# EAGLE schematic ManualOxy (EAGLE 6.5.0)
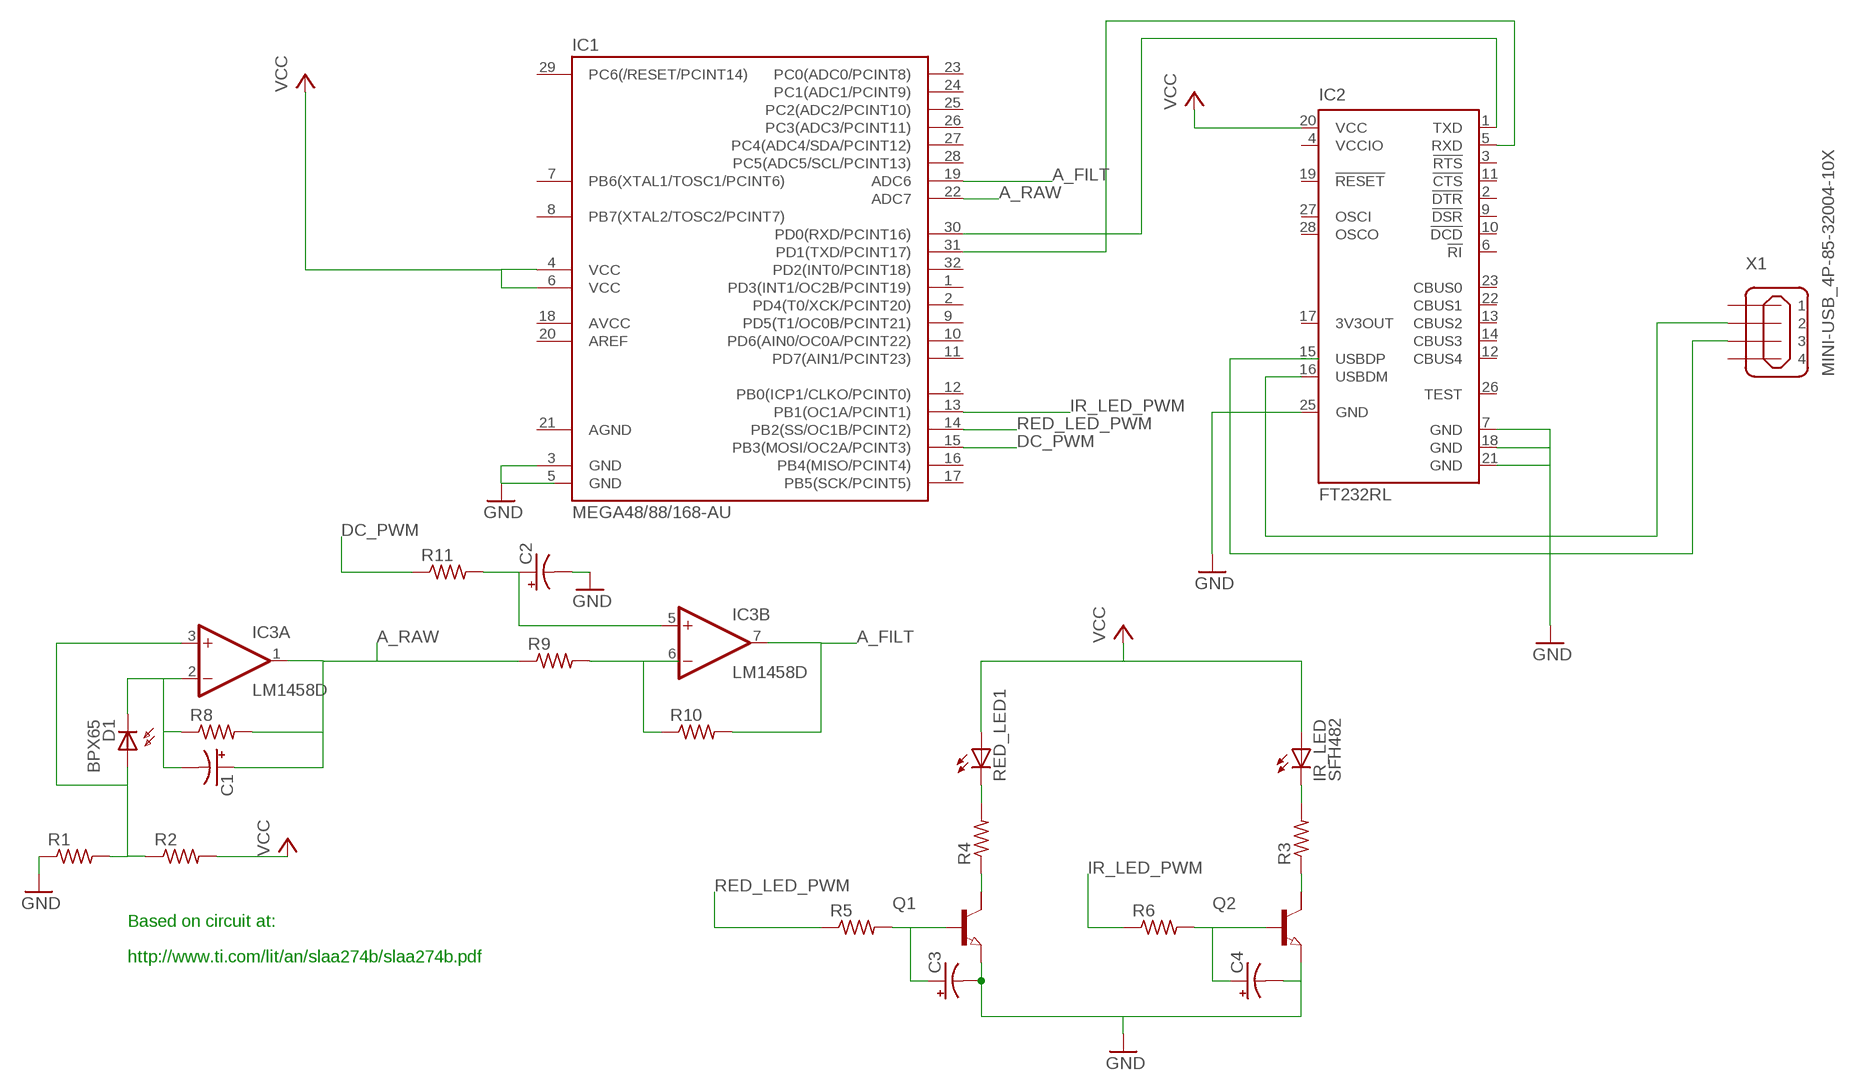
[diagram p0: schematic, sheet 1]

## Parts
C1  CPOL-US153CLV-0810  [153CLV-0810]
C2  CPOL-US153CLV-0810  [153CLV-0810]
C3  CPOL-US153CLV-0810  [153CLV-0810]
C4  CPOL-US153CLV-0810  [153CLV-0810]
D1  BPX65  [BPX65]
IC1  MEGA48/88/168-AU  [TQFP32-08]
IC2  FT232RL  [SSOP28]
IC3  LM1458D  [SO08]
IR_LED  SFH482  [SFH482]
Q1  NPN-TRANSISTIOR-2COLSOT143  [SOT143]
Q2  NPN-TRANSISTIOR-2COLSOT143  [SOT143]
R1  R-US_M2012  [M2012]
R2  R-US_M2012  [M2012]
R3  R-US_M2012  [M2012]
R4  R-US_M2012  [M2012]
R5  R-US_M2012  [M2012]
R6  R-US_M2012  [M2012]
R8  R-US_M2012  [M2012]
R9  R-US_M2012  [M2012]
R10  R-US_M2012  [M2012]
R11  R-US_M2012  [M2012]
RED_LED1  LED10MM  [LED10MM]
X1  MINI-USB_4P-85-32004-10X  [85-32004-10X]

## Nets
A_FILT: IC3.7(B:OUT) R10.2
A_RAW: C1.+ IC3.1(A:OUT) R8.2 R9.1
DC_PWM: IC1.15(PB3(MOSI/OC2A/PCINT3))
GND: C2.- C3.- C4.- IC1.3(GND) IC2.7(GND) IC2.18(GND) IC2.21(GND) IC2.25(GND) Q1.3(E) Q2.3(E) R1.1
IR_LED_PWM: IC1.13(PB1(OC1A/PCINT1))
N$1: IC1.30(PD0(RXD/PCINT16)) IC2.1(TXD)
N$2: IC1.31(PD1(TXD/PCINT17)) IC2.5(RXD)
N$3: IC2.16(USBDM) X1.2
N$4: X1.3
N$5: Q1.2(C) R4.1
N$6: R4.2 RED_LED1.K(C)
N$7: IR_LED.K(C) R3.2
N$8: Q2.2(C) R3.1
N$9: D1.A IC3.3(A:+IN) R1.2 R2.1
N$10: C1.- D1.K(C) IC3.2(A:-IN) R8.1
N$11: IC1.22(ADC7)
N$12: R9.2 R10.1
N$13: IC1.19(ADC6)
N$14: C2.+ IC3.5(B:+IN) R11.2
N$15: R11.1
N$16: C3.+ Q1.1(B) R5.2
N$17: R6.1
N$18: C4.+ Q2.1(B) R6.2
RED_LED_PWM: IC1.14(PB2(SS/OC1B/PCINT2))
VCC: IC1.4(VCC) IC1.6(VCC) IC2.20(VCC) IR_LED.A R2.2 RED_LED1.A
Unconnected: IC1.1(PD3(INT1/OC2B/PCINT19)) IC1.2(PD4(T0/XCK/PCINT20)) IC1.7(PB6(XTAL1/TOSC1/PCINT6)) IC1.8(PB7(XTAL2/TOSC2/PCINT7)) IC1.9(PD5(T1/OC0B/PCINT21)) IC1.10(PD6(AIN0/OC0A/PCINT22)) IC1.11(PD7(AIN1/PCINT23)) IC1.12(PB0(ICP1/CLKO/PCINT0)) IC1.16(PB4(MISO/PCINT4)) IC1.17(PB5(SCK/PCINT5)) IC1.18(AVCC) IC1.20(AREF) IC1.23(PC0(ADC0/PCINT8)) IC1.24(PC1(ADC1/PCINT9)) IC1.25(PC2(ADC2/PCINT10)) IC1.26(PC3(ADC3/PCINT11)) IC1.27(PC4(ADC4/SDA/PCINT12)) IC1.28(PC5(ADC5/SCL/PCINT13)) IC1.29(PC6(/RESET/PCINT14)) IC1.32(PD2(INT0/PCINT18)) IC2.2(!DTR) IC2.3(!RTS) IC2.6(!RI) IC2.9(!DSR) IC2.10(!DCD) IC2.11(!CTS) IC2.12(CBUS4) IC2.13(CBUS2) IC2.14(CBUS3) IC2.15(USBDP) IC2.17(3V3OUT) IC2.19(!RESET) IC2.22(CBUS1) IC2.23(CBUS0) IC2.26(TEST) IC2.27(OSCI) IC2.28(OSCO) IC3.6(B:-IN) Q1.4(C/) Q2.4(C/) R5.1 X1.1 X1.4

## Notes on the sheet
- Based on circuit at:
- http://www.ti.com/lit/an/slaa274b/slaa274b.pdf

## Power pins joined to a net without a drawn wire
AGND: IC1.21(AGND)
GND: IC1.5(GND)
V+: IC3.8(P:V+)
V-: IC3.4(P:V-)
VCCIO: IC2.4(VCCIO)

## Library data of the parts
C1-C4 = resistor:CPOL-US: POLARIZED CAPACITOR, American symbol
D1 = opto-trans-siemens:BPX65: PHOTO DIODE; MPN: BPX65.; OC_FARNELL: 327451; OC_NEWARK: 06WX2764
IC1 = avr-4:MEGA48/88/168
IC2 = ftdichip:FT232R: Source: http://www.ftdichip.com/Documents/DataSheets/DS_FT232R_v104.pdf; MPN: FT232RL; OC_FARNELL: 1146032; OC_NEWARK: 91K9918
IC3 = linear:*1458: OP AMP
IR_LED = led:SFH482: IR LED infrared emitting diode, Infineon
Q1 Q2 = semicon-smd-ipc:NPN-TRANSISTIOR-2COL: NPN TRANSISTOR 2 colletor pins
R1-R6 R8-R11 = rcl:R-US_: RESISTOR, American symbol
RED_LED1 = led:LED: LED OSRAM: - CHIPLED LG R971, LG N971, LY N971, LG Q971, LY Q971, LO R971, LY R971 LH N974, LH R974 LS Q976, LO Q976, LY Q976 LO Q996 - Hyper CHIPLED LW Q18S LB Q993, LB Q99A, LB R99A - SideLED LS A670, LO A670, LY A670, LG A670, LP A670 LB A673, LV A673, LT A673, LW A673 LH A674 LY A675 LS A676, LA A676, LO A676, LY A676, LW A676 LS A679, LY A679, LG A679 - Hyper Micro SIDELED® LS Y876, LA Y876, LO Y876, LY Y876 LT Y87S - SmartLED LW L88C, LW L88S LB L89C, LB L89S, LG L890 LS L89K, LO L89K, LY L89K LS L896, LA L896, LO L896, LY L896 - TOPLED LS T670, LO T670, LY T670, LG T670, LP T670 LSG T670, LSP T670, LSY T670, LOP T670, LYG T670 LG T671, LOG T671, LSG T671 LB T673, LV T673, LT T673, LW T673 LH T674 LS T676, LA T676, LO T676, LY T676, LB T676, LH T676, LSB T676, LW T676 LB T67C, LV T67C, LT T67C, LS T67K, LO T67K, LY T67K, LW E67C LS E67B, LA E67B, LO E67B, LY E67B, LB E67C, LV E67C, LT E67C LW T67C LS T679, LY T679, LG T679 LS T770, LO T770, LY T770, LG T770, LP T770 LB T773, LV T773, LT T773, LW T773 LH T774 LS E675, LA E675, LY E675, LS T675 LS T776, LA T776, LO T776, LY T776, LB T776 LHGB T686 LT T68C, LB T68C - Hyper Mini TOPLED® LB M676 - Mini TOPLED Santana® LG M470 LS M47K, LO M47K, LY M47K Source: http://www.osram.convergy.de LUXEON: - LUMILED® LXK2-PW12-R00, LXK2-PW12-S00, LXK2-PW14-U00, LXK2-PW14-V00 LXK2-PM12-R00, LXK2-PM12-S00, LXK2-PM14-U00 LXK2-PE12-Q00, LXK2-PE12-R00, LXK2-PE12-S00, LXK2-PE14-T00, LXK2-PE14-U00 LXK2-PB12-K00, LXK2-PB12-L00, LXK2-PB12-M00, LXK2-PB14-N00, LXK2-PB14-P00, LXK2-PB14-Q00 LXK2-PR12-L00, LXK2-PR12-M00, LXK2-PR14-Q00, LXK2-PR14-R00 LXK2-PD12-Q00, LXK2-PD12-R00, LXK2-PD12-S00 LXK2-PH12-R00, LXK2-PH12-S00 LXK2-PL12-P00, LXK2-PL12-Q00, LXK2-PL12-R00 Source: www.luxeon.com KINGBRIGHT: KA-3528ASYC Source: www.kingbright.com
X1 = con-cypressindustries:MINI-USB_4P-: MINI USB 4 Pol. Source: www.cypressindustries.com; OC_FARNELL: unknown; OC_NEWARK: unknown